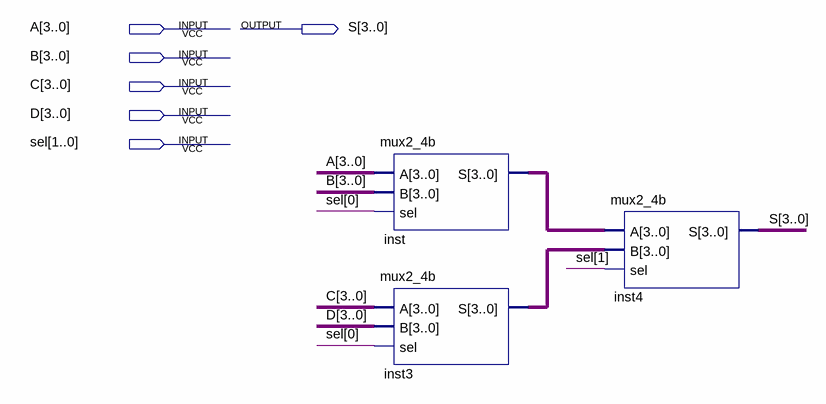
[diagram p0: schematic sheet]
// Quartus schematic mux4_4b.bdf as structural Verilog: 3 symbols, 6 pins
module mux4_4b (
  input  [3:0] A,
  input  [3:0] B,
  input  [3:0] C,
  input  [3:0] D,
  input  [1:0] sel,
  output [3:0] S
);

  wire [3:0] inst3_s, inst_s;

  mux2_4b inst (.A(A), .B(B), .sel(sel[0]), .S(inst_s));
  mux2_4b inst3 (.A(C), .B(D), .sel(sel[0]), .S(inst3_s));
  mux2_4b inst4 (.A(inst_s), .B(inst3_s), .sel(sel[1]), .S(S));
endmodule
